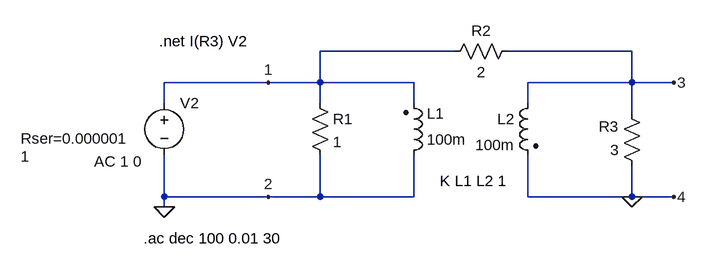
[diagram p0: schematic Trafo Ej #1.asc]
Trafo Ej #1.asc, the LTspice schematic file:
Version 4
SHEET 1 880 680
WIRE 480 64 272 64
WIRE 752 64 560 64
WIRE 192 112 32 112
WIRE 272 112 272 64
WIRE 272 112 192 112
WIRE 416 112 272 112
WIRE 752 112 752 64
WIRE 752 112 592 112
WIRE 816 112 752 112
WIRE 32 144 32 112
WIRE 272 144 272 112
WIRE 416 144 416 112
WIRE 592 144 592 112
WIRE 752 160 752 112
WIRE 32 288 32 224
WIRE 192 288 32 288
WIRE 272 288 272 224
WIRE 272 288 192 288
WIRE 416 288 416 224
WIRE 416 288 272 288
WIRE 592 288 592 224
WIRE 752 288 752 240
WIRE 752 288 592 288
WIRE 816 288 752 288
WIRE 32 304 32 288
FLAG 192 112 1
FLAG 192 288 2
FLAG 816 112 3
FLAG 816 288 4
FLAG 32 304 0
FLAG 752 288 0
SYMBOL voltage 32 128 R0
WINDOW 3 -221 98 Left 2
WINDOW 123 -108 106 Left 2
WINDOW 39 -221 70 Left 2
SYMATTR Value 1
SYMATTR Value2 AC 1 0
SYMATTR SpiceLine Rser=0.000001
SYMATTR InstName V2
SYMBOL res 256 128 R0
SYMATTR InstName R1
SYMATTR Value 1
SYMBOL res 576 48 R90
WINDOW 0 0 56 VBottom 2
WINDOW 3 32 56 VTop 2
SYMATTR InstName R2
SYMATTR Value 2
SYMBOL res 768 256 R180
WINDOW 0 36 76 Left 2
WINDOW 3 36 40 Left 2
SYMATTR InstName R3
SYMATTR Value 3
SYMBOL ind2 400 240 M180
WINDOW 0 36 80 Left 2
WINDOW 3 36 40 Left 2
SYMATTR InstName L1
SYMATTR Value 100m
SYMATTR Type ind
SYMBOL ind2 608 128 M0
SYMATTR InstName L2
SYMATTR Value 100m
SYMATTR Type ind
TEXT 456 264 Left 2 !K L1 L2 1
TEXT 24 48 Left 2 !.net I(R3) V2
TEXT 0 352 Left 2 !.ac dec 100 0.01 30

The netlist it stands for:
* Trafo Ej #1.asc
V2 1 0 1 AC 1 0 Rser=0.000001
R1 1 0 1
R2 3 1 2
R3 0 3 3
L1 0 1 100m
L2 3 0 100m
K L1 L2 1
.net I(R3) V2
.ac dec 100 0.01 30
.backanno
.end